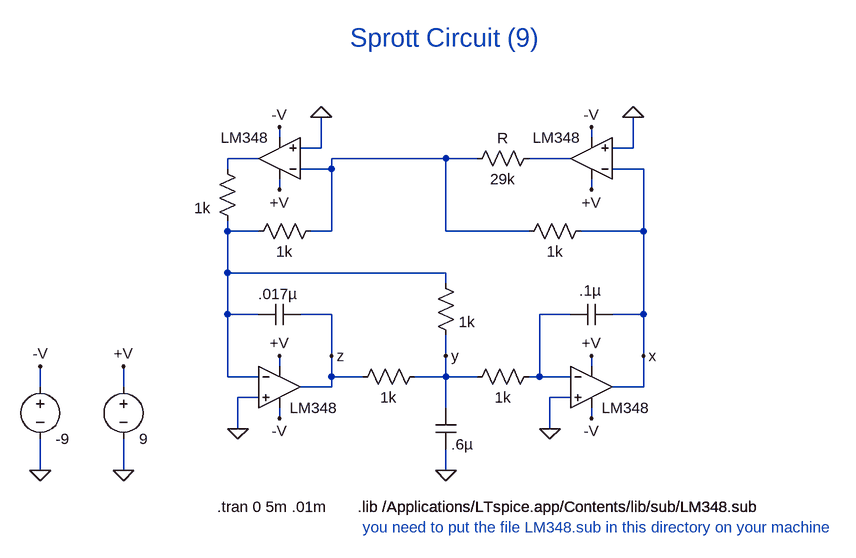
[diagram p0: schematic oscillator (LM348).asc]
oscillator (LM348).asc, the LTspice schematic file:
Version 4
SHEET 1 1092 1188
WIRE 0 32 0 16
WIRE 480 32 480 16
WIRE 64 48 64 0
WIRE 64 48 32 48
WIRE 544 48 544 0
WIRE 544 48 512 48
WIRE -32 64 -80 64
WIRE 256 64 80 64
WIRE 304 64 256 64
WIRE 448 64 384 64
WIRE -80 80 -80 64
WIRE 80 80 80 64
WIRE 80 80 32 80
WIRE 560 80 512 80
WIRE 0 112 0 96
WIRE 480 112 480 96
WIRE -80 176 -80 160
WIRE -32 176 -80 176
WIRE 80 176 80 80
WIRE 80 176 48 176
WIRE 256 176 256 64
WIRE 384 176 256 176
WIRE 560 176 560 80
WIRE 560 176 464 176
WIRE -80 240 -80 176
WIRE 256 240 -80 240
WIRE 256 256 256 240
WIRE -80 304 -80 240
WIRE -32 304 -80 304
WIRE 80 304 32 304
WIRE 448 304 400 304
WIRE 560 304 560 176
WIRE 560 304 512 304
WIRE 80 368 80 304
WIRE 256 368 256 336
WIRE 560 368 560 304
WIRE 0 384 0 368
WIRE 480 384 480 368
WIRE -80 400 -80 304
WIRE -32 400 -80 400
WIRE 80 400 80 368
WIRE 128 400 80 400
WIRE 256 400 256 368
WIRE 256 400 208 400
WIRE 304 400 256 400
WIRE 400 400 400 304
WIRE 400 400 384 400
WIRE 448 400 400 400
WIRE -368 416 -368 384
WIRE -240 416 -240 384
WIRE 80 416 80 400
WIRE 80 416 32 416
WIRE 560 416 560 368
WIRE 560 416 512 416
WIRE -32 432 -64 432
WIRE 448 432 416 432
WIRE 256 448 256 400
WIRE 0 464 0 448
WIRE 480 464 480 448
WIRE -64 480 -64 432
WIRE 416 480 416 432
WIRE -368 544 -368 496
WIRE -240 544 -240 496
WIRE 256 544 256 512
FLAG 256 544 0
FLAG 416 480 0
FLAG -64 480 0
FLAG 64 0 0
FLAG 544 0 0
FLAG -368 544 0
FLAG 560 368 x
FLAG 256 368 y
FLAG 80 368 z
FLAG 0 464 -V
FLAG 0 368 +V
FLAG 480 368 +V
FLAG 480 112 +V
FLAG 0 112 +V
FLAG 480 16 -V
FLAG 0 16 -V
FLAG 480 464 -V
FLAG -240 544 0
FLAG -240 384 +V
FLAG -368 384 -V
SYMBOL cap 512 288 R90
WINDOW 0 0 32 Invisible 2
WINDOW 3 -36 34 VTop 2
SYMATTR InstName C2
SYMATTR Value .1µ
SYMBOL res 400 384 R90
WINDOW 0 0 56 Invisible 2
WINDOW 3 32 56 VTop 2
SYMATTR InstName R2
SYMATTR Value 1k
SYMBOL cap 240 448 R0
WINDOW 0 24 8 Invisible 2
SYMATTR InstName C1
SYMATTR Value .6µ
SYMBOL res 224 384 R90
WINDOW 0 0 56 Invisible 2
WINDOW 3 32 56 VTop 2
SYMATTR InstName R3
SYMATTR Value 1k
SYMBOL cap 32 288 R90
WINDOW 0 0 32 Invisible 2
WINDOW 3 -31 34 VTop 2
SYMATTR InstName C3
SYMATTR Value .017µ
SYMBOL res -96 64 R0
WINDOW 0 -34 38 Invisible 2
WINDOW 3 -35 76 Left 2
SYMATTR InstName R5
SYMATTR Value 1k
SYMBOL res 64 160 R90
WINDOW 0 0 56 Invisible 2
WINDOW 3 32 56 VTop 2
SYMATTR InstName R4
SYMATTR Value 1k
SYMBOL res 400 48 R90
WINDOW 0 0 56 VBottom 2
WINDOW 3 32 56 VTop 2
SYMATTR InstName R
SYMATTR Value 29k
SYMBOL res 480 160 R90
WINDOW 0 0 56 Invisible 2
WINDOW 3 32 56 VTop 2
SYMATTR InstName R1
SYMATTR Value 1k
SYMBOL res 240 240 R0
WINDOW 0 36 40 Invisible 2
SYMATTR InstName R6
SYMATTR Value 1k
SYMBOL voltage -368 400 R0
WINDOW 0 24 16 Invisible 2
SYMATTR InstName V2
SYMATTR Value -9
SYMBOL voltage -240 400 R0
WINDOW 0 24 16 Invisible 2
SYMATTR InstName V1
SYMATTR Value 9
SYMBOL opamp2 0 128 R180
WINDOW 0 16 32 Invisible 2
SYMATTR InstName U4
SYMATTR Value LM348
SYMBOL opamp2 0 352 R0
WINDOW 0 16 32 Invisible 2
SYMATTR InstName U1
SYMATTR Value LM348
SYMBOL opamp2 480 352 R0
WINDOW 0 16 32 Invisible 2
SYMATTR InstName U2
SYMATTR Value LM348
SYMBOL opamp2 480 128 R180
WINDOW 0 16 32 Invisible 2
SYMATTR InstName U3
SYMATTR Value LM348
TEXT -96 600 Left 2 !.tran 0 5m .01m
TEXT 256 -96 Bottom 4 ;Sprott Circuit (9)
TEXT 120 600 Left 2 !.lib /Applications/LTspice.app/Contents/lib/sub/LM348.sub
TEXT 128 632 Left 2 ;you need to put the file LM348.sub in this directory on your machine
TEXT 120 600 Left 2 !.lib /Applications/LTspice.app/Contents/lib/sub/LM348.sub
TEXT 120 600 Left 2 !.lib /Applications/LTspice.app/Contents/lib/sub/LM348.sub

The netlist it stands for:
* oscillator (LM348).asc
C2 x N005 .1µ
R2 N005 y 1k
C1 y 0 .6µ
R3 y z 1k
C3 z N004 .017µ
R5 N001 N004 1k
R4 N002 N004 1k
R N003 N002 29k
R1 x N002 1k
R6 N004 y 1k
V2 -V 0 -9
V1 +V 0 9
XU4 0 N002 +V -V N001 LM348  ; pins In+ In- V+ V- OUT
XU1 0 N004 +V -V z LM348  ; pins In+ In- V+ V- OUT
XU2 0 N005 +V -V x LM348  ; pins In+ In- V+ V- OUT
XU3 0 x +V -V N003 LM348  ; pins In+ In- V+ V- OUT
.tran 0 5m .01m
* Sprott Circuit (9)
.lib /Applications/LTspice.app/Contents/lib/sub/LM348.sub
* you need to put the file LM348.sub in this directory on your machine
.lib /Applications/LTspice.app/Contents/lib/sub/LM348.sub
.lib /Applications/LTspice.app/Contents/lib/sub/LM348.sub
.backanno
.end